# EAGLE design Adapter_V1.0 (EAGLE 9.4.1)
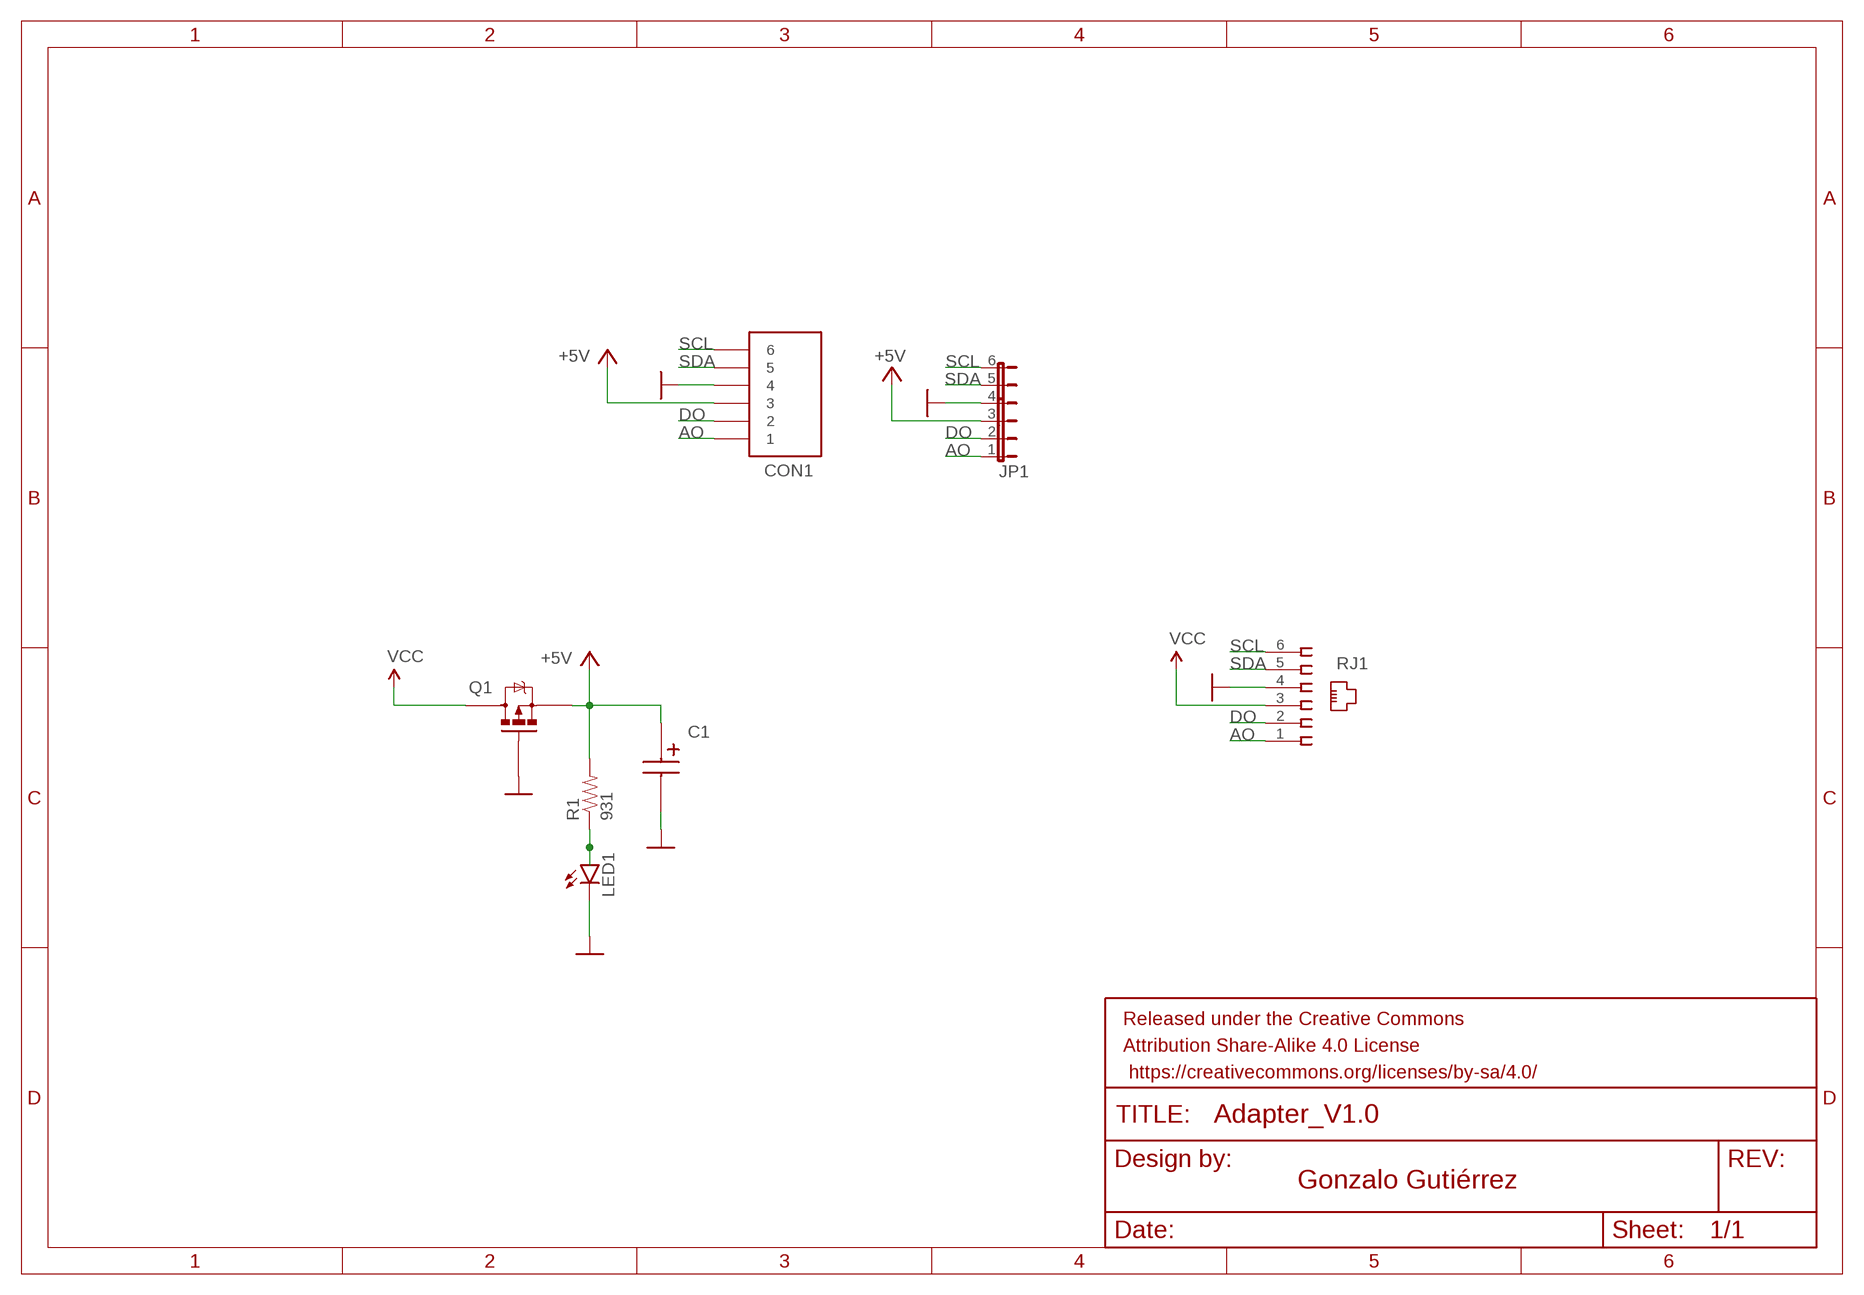
[diagram p0: schematic, sheet 1]

## Parts
C1  220uF  860010372006  [CAPPRD200W80D500H1100]
CON1  1990041KF250A-2.5-6P  [KF250A-2.5-6P]
JP1  JP6E  [JP6]
LED1  LED0603  [LED-0603]
Q1  IRLML2244TRPBF  [SOT95P237X112-3N]
R1  931  RES_0402  [RESC1005X35]
RJ1  615006138421  [615006138421]

## Nets
+5V: C1.1(+) CON1.3 JP1.3 Q1.2(S) R1.2
AO: CON1.1 JP1.1 RJ1.1
DO: CON1.2 JP1.2 RJ1.2
GND: C1.2(-) CON1.4 JP1.4 LED1.C Q1.1(G) RJ1.4
N$5: LED1.A R1.1
SCL: CON1.6 JP1.6 RJ1.6
SDA: CON1.5 JP1.5 RJ1.5
VCC: Q1.3(D) RJ1.3

## Library data of the parts
C1 = 860010372006:860010372006: Wurth Elektronik 100uF 16 V dc Aluminium Electrolytic Capacitor, WCAP-ATG8 Series 2000h 5 (Dia.) x 11mm Source: Datasheet <http://uk.rs-online.com/web/p/products/1636051>; DESCRIPTION: Wurth Elektronik 100uF 16 V dc Aluminium Electrolytic Capacitor, WCAP-ATG8 Series 2000h 5 (Dia.) x 11mm; HEIGHT: 11mm; MANUFACTURER_NAME: Wurth Elektronik; MANUFACTURER_PART_NUMBER: 860010372006; MPN: 227CKS010M
CON1 = PhoenixContact:1990041; MPN: 1990041
JP1 = jump_byme:JP6E
LED1 = SparkFun-LED:LED: LEDs Standard schematic elements and footprints for 5mm, 3mm, 1206, and 0603 sized LEDs. 5mm - Spark Fun Electronics SKU : COM-00529 (and others); MPN: LTST-C193KRKT-5A
Q1 = IRLML2244TRPBF:IRLML2244TRPBF: HEXFET Power MOSFET Source: Datasheet; ARROW_PART_NUMBER: IRLML2244TRPBF; DESCRIPTION: HEXFET Power MOSFET; HEIGHT: mm; MANUFACTURER_NAME: International Rectifier; MANUFACTURER_PART_NUMBER: IRLML2244TRPBF; MPN: IRLML2244TRPBF
R1 = Perfect_0402:RES_0402; MPN: RC0402FR-07931RL
RJ1 = 615006138421:615006138421: HORIZONTAL PLASTIC 6P6C MODULAR JACK TAP UP Source: Datasheet <http://docs-europe.electrocomponents.com/webdocs/0f88/0900766b80f88670.pdf>; DESCRIPTION: HORIZONTAL PLASTIC 6P6C MODULAR JACK TAP UP; HEIGHT: mm; MANUFACTURER_NAME: W&uuml;rth Elektronik; MANUFACTURER_PART_NUMBER: 615006138421; MPN: 615006138421; RS_PART_NUMBER: 7350282; SUPPLIER_NAME: RS

## Board
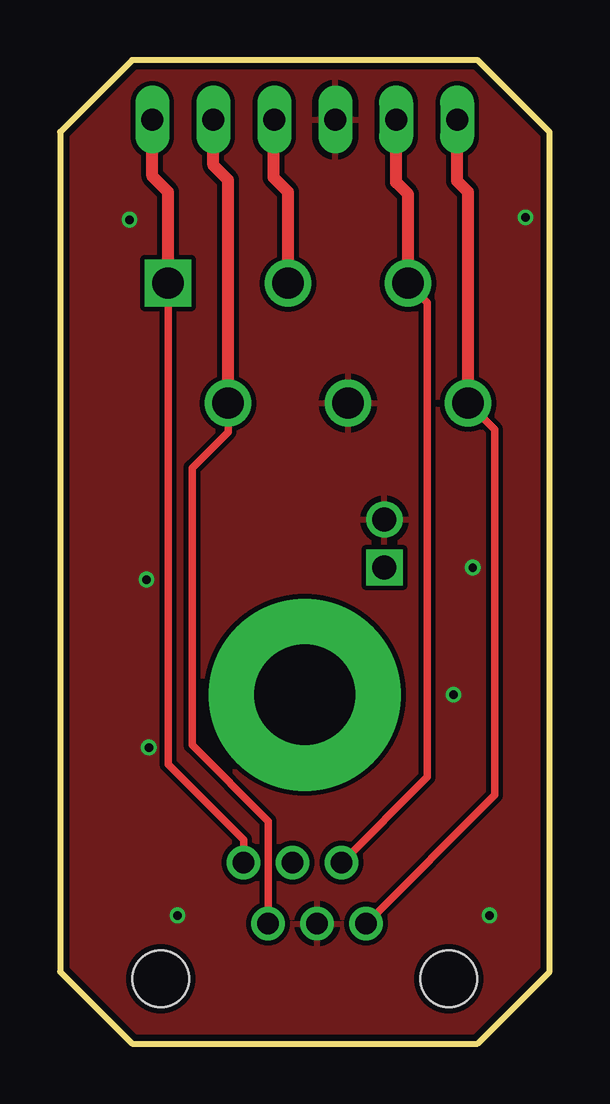
[diagram p1: board, top side]
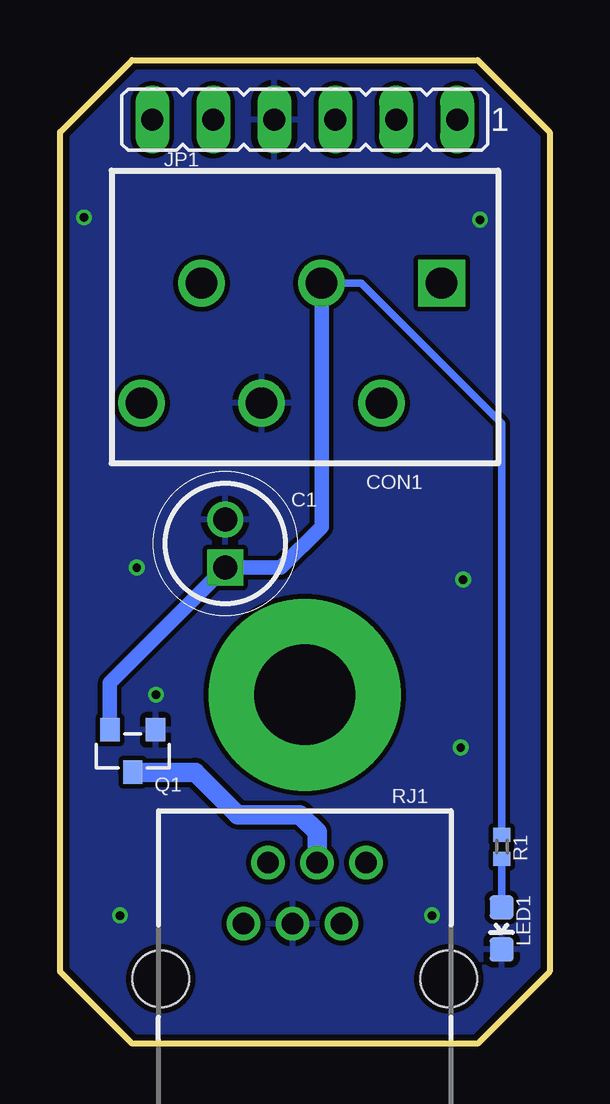
[diagram p2: board, bottom side, seen from below]

Size 20.4 x 41 mm. Coordinates in mm from the lower left corner, seen from the top.
Outline: 0,38 0,3 3,0 17.4,0 20.4,3 20.4,38 17.4,41 3,41 0,38
Copper layers (1*16): Top 0.035mm / dielectric 1.5mm / Bottom 0.035mm
Design rules "SeeedStudio_2layer_DRU_no_angle_20140221": minimum track width 6mil, minimum drill 12mil, track to track 6mil, track to pad 6mil, pad to pad 6mil, via to via 6mil, smd to smd 0mil, copper to edge 10mil, drill to drill 10mil, minimum pad ring 10mil, minimum via ring 6mil, stop-mask expansion 2mil, vias tented up to drill 100mil, thermal gap 10mil

### Footprints (pad centres in the part's own frame; a part is rotated, then mirrored left to right if it is on the bottom)
CAPPRD200W80D500H1100 = drill 1 pad 1.5 square: 1 0,0 | drill 1 pad 1.5: 2 2,0
KF250A-2.5-6P = drill 1.3 square: 1 -6.25,-2.5 | drill 1.3: 2 -3.75,2.5; 3 -1.25,-2.5; 4 1.25,2.5; 5 3.75,-2.5; 6 6.25,2.5
JP6 = drill 0.914 long: 1 -6.35,0; 2 -3.81,0; 3 -1.27,0; 4 1.27,0; 5 3.81,0; 6 6.35,0
LED-0603 = smd 1 x 1: A 0,-0.877; C 0,0.877
SOT95P237X112-3N = smd 0.972 x 0.802: 1 -0.885,0.95; 2 -0.885,-0.95; 3 0.885,0
RESC1005X35 = smd 0.6 x 0.7: 1 -0.5,0; 2 0.5,0
615006138421 = drill 0.9 pad 1.4: 1 2.55,4.84; 2 1.53,2.3; 3 0.51,4.84; 4 -0.51,2.3; 5 -1.53,4.84; 6 -2.55,2.3 | hole 2.36: -6,0; 6,0

### Placement (x,y rotation side)
C1  13.52,19.84 90 bottom
CON1  10.75,29.19 180 bottom
JP1  10.2,38.52 180 bottom
LED1  2,4.8 180 bottom
Q1  17.37,12.19 270 bottom
R1  1.99,8.2 90 bottom
RJ1  10.2,2.7 0 bottom

### Tracks (layer width: path | path; a pad name or v marks a point on that pad's centre or on a via)
+5V
  Top 0.508: CON1.3 9.5,35.5 8.9,36.1 8.9,38.48 JP1.3
  Bottom 0.305: R1.2 2,8.71 2,25.84 7.85,31.69 CON1.3
  Bottom 0.61: Q1.2 18.32,15.04 C1.1 11.2,19.84 9.5,21.54 CON1.3
AO
  Top 0.305: RJ1.1 7.65,8.49 4.5,11.64 CON1.1
  Top 0.508: CON1.1 4.5,35.5 3.85,36.15 JP1.1
DO
  Top 0.305: RJ1.2 8.67,9.27 5.5,12.44 5.5,24 7,25.5 CON1.2
  Top 0.508: JP1.2 6.39,36.61 7,36 CON1.2
GND  (via drill 0.35)
  other vias: 2.9,34.34 3.6,19.34 4.9,5.34 17.9,5.34 17.2,19.84 19.4,34.44 3.7,12.34 16.4,14.54
  pour Bottom (isolate 0.2): 20.4,41.24 0,41.24 0,0 20.4,0
  pour Top (isolate 0.2): 20.4,41.24 20.4,0 0,0 0,41.24
N$5
  Bottom 0.305: LED1.A R1.1
N$6  (via drill 4.2 pad 8)
  other vias: 10.2,14.54
SCL
  Top 0.305: RJ1.6 18.11,10.36 18.11,25.59 CON1.6
  Top 0.508: CON1.6 17,35.5 16.55,35.95 JP1.6
SDA
  Top 0.305: RJ1.5 15.3,11.11 15.3,30.89 CON1.5
  Top 0.508: CON1.5 14.5,35.4 14,35.9 14,38.51 JP1.5
VCC
  Bottom 0.813: RJ1.3 9.69,8.83 10.4,9.54 13,9.54 14.77,11.31 Q1.3